# EAGLE design design (EAGLE 9.5.1)
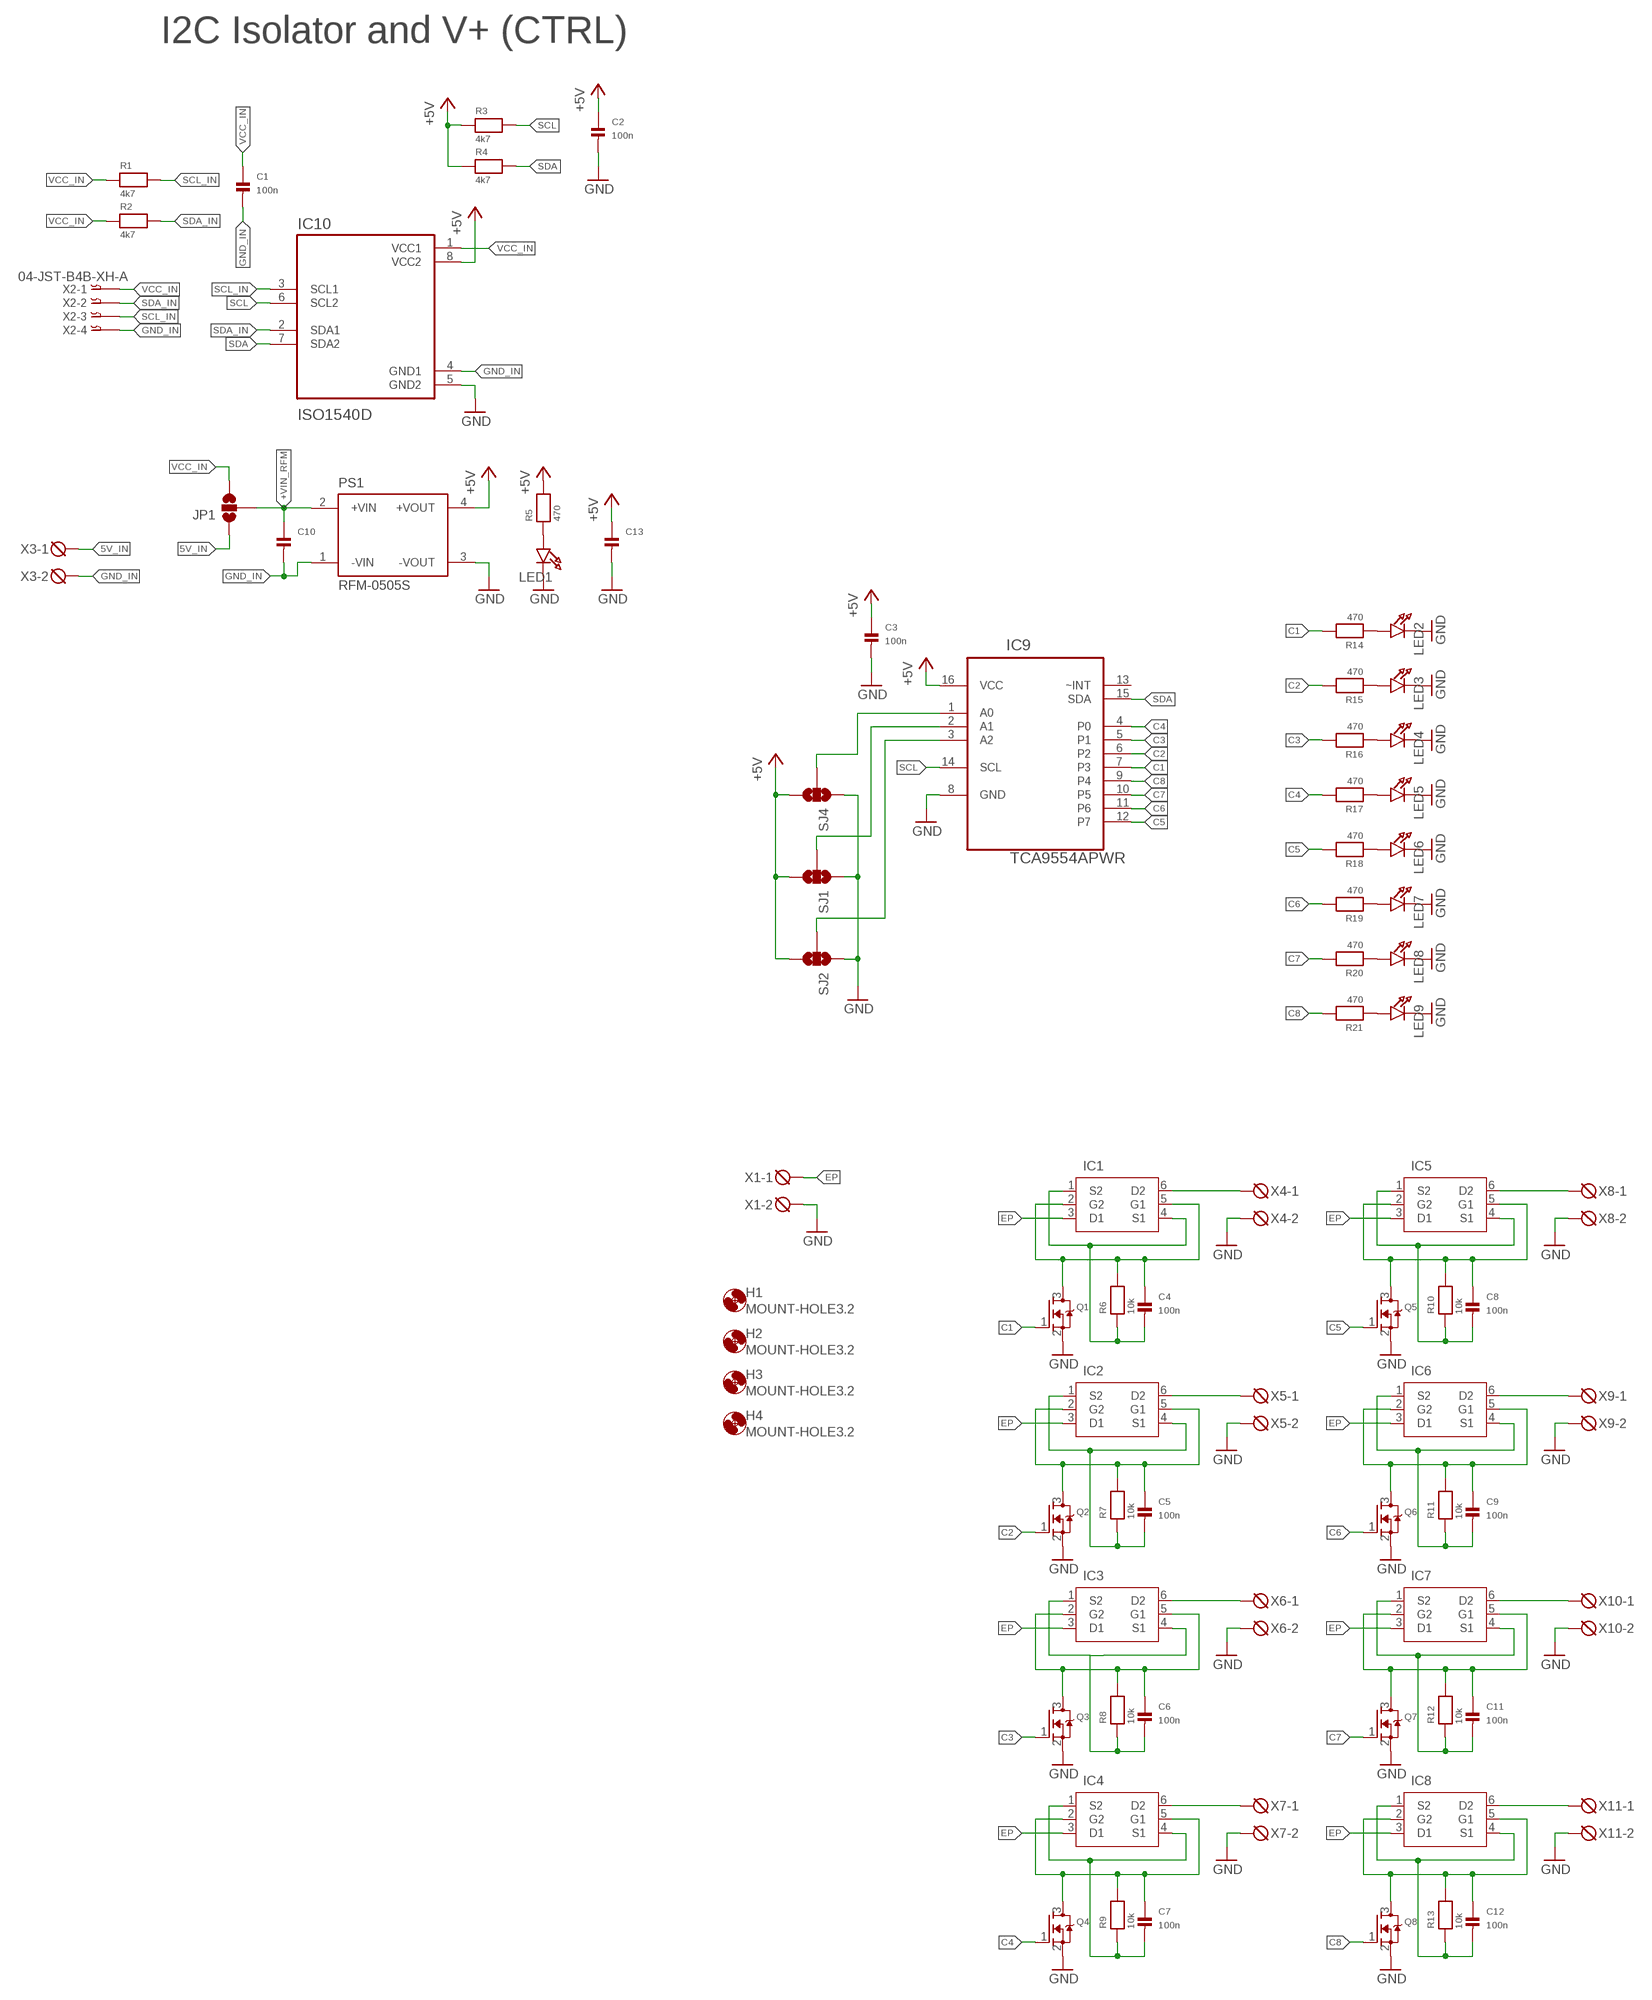
[diagram p0: schematic, sheet 1]

## Parts
C1  100n  CAP_CERAMIC0603  [0603]
C2  100n  CAP_CERAMIC0603  [0603]
C3  100n  CAP_CERAMIC0603  [0603]
C4  100n  CAP_CERAMIC0603  [0603]
C5  100n  CAP_CERAMIC0603  [0603]
C6  100n  CAP_CERAMIC0603  [0603]
C7  100n  CAP_CERAMIC0603  [0603]
C8  100n  CAP_CERAMIC0603  [0603]
C9  100n  CAP_CERAMIC0603  [0603]
C10  CAP_CERAMIC0805  [0805]
C11  100n  CAP_CERAMIC0603  [0603]
C12  100n  CAP_CERAMIC0603  [0603]
C13  CAP_CERAMIC0805  [0805]
H1  MOUNT-HOLE3.2  [3,2]
H2  MOUNT-HOLE3.2  [3,2]
H3  MOUNT-HOLE3.2  [3,2]
H4  MOUNT-HOLE3.2  [3,2]
IC1  DMP2200UDW  [SOT65P210X110-6N]
IC2  DMP2200UDW  [SOT65P210X110-6N]
IC3  DMP2200UDW  [SOT65P210X110-6N]
IC4  DMP2200UDW  [SOT65P210X110-6N]
IC5  DMP2200UDW  [SOT65P210X110-6N]
IC6  DMP2200UDW  [SOT65P210X110-6N]
IC7  DMP2200UDW  [SOT65P210X110-6N]
IC8  DMP2200UDW  [SOT65P210X110-6N]
IC9  TCA9554APWR  [SOP65P640X120-16N]
IC10  ISO1540D  [SOIC127P599X175-8N]
JP1  JUMPER-SMT_3_NO_SILK  [SMT-JUMPER_3_NO_SILK]
LED1  LED0805  [CHIPLED_0805]
LED2  LED0805  [CHIPLED_0805]
LED3  LED0805  [CHIPLED_0805]
LED4  LED0805  [CHIPLED_0805]
LED5  LED0805  [CHIPLED_0805]
LED6  LED0805  [CHIPLED_0805]
LED7  LED0805  [CHIPLED_0805]
LED8  LED0805  [CHIPLED_0805]
LED9  LED0805  [CHIPLED_0805]
PS1  RFM-0505S  [CONV_RFM-0505S]
Q1  MOSFET-NREFLOW  [SOT23-R]
Q2  MOSFET-NREFLOW  [SOT23-R]
Q3  MOSFET-NREFLOW  [SOT23-R]
Q4  MOSFET-NREFLOW  [SOT23-R]
Q5  MOSFET-NREFLOW  [SOT23-R]
Q6  MOSFET-NREFLOW  [SOT23-R]
Q7  MOSFET-NREFLOW  [SOT23-R]
Q8  MOSFET-NREFLOW  [SOT23-R]
R1  4k7  RESISTOR0603  [0603]
R2  4k7  RESISTOR0603  [0603]
R3  4k7  RESISTOR0603  [0603]
R4  4k7  RESISTOR0603  [0603]
R5  470  RESISTOR0603  [0603]
R6  10k  RESISTOR0603  [0603]
R7  10k  RESISTOR0603  [0603]
R8  10k  RESISTOR0603  [0603]
R9  10k  RESISTOR0603  [0603]
R10  10k  RESISTOR0603  [0603]
R11  10k  RESISTOR0603  [0603]
R12  10k  RESISTOR0603  [0603]
R13  10k  RESISTOR0603  [0603]
R14  470  RESISTOR0603  [0603]
R15  470  RESISTOR0603  [0603]
R16  470  RESISTOR0603  [0603]
R17  470  RESISTOR0603  [0603]
R18  470  RESISTOR0603  [0603]
R19  470  RESISTOR0603  [0603]
R20  470  RESISTOR0603  [0603]
R21  470  RESISTOR0603  [0603]
SJ1  SOLDERJUMPER_2WAYS  [SJ_3]
SJ2  SOLDERJUMPER_2WAYS  [SJ_3]
SJ4  SOLDERJUMPER_2WAYS  [SJ_3]
X1  DG3XX-02-5.0  [DG306-5.0-02P]
X2  04-JST-B4B-XH-A  [B4B-XH]
X3  DG3XX-02-5.0  [DG306-5.0-02P]
X4  DG3XX-02-5.0  [DG306-5.0-02P]
X5  DG3XX-02-5.0  [DG306-5.0-02P]
X6  DG3XX-02-5.0  [DG306-5.0-02P]
X7  DG3XX-02-5.0  [DG306-5.0-02P]
X8  DG3XX-02-5.0  [DG306-5.0-02P]
X9  DG3XX-02-5.0  [DG306-5.0-02P]
X10  DG3XX-02-5.0  [DG306-5.0-02P]
X11  DG3XX-02-5.0  [DG306-5.0-02P]

## Nets
5V_IN: JP1.1 X3.1
+5V: C2.1 C3.1 C13.1 IC9.16(VCC) IC10.8(VCC2) PS1.4(+VOUT) R3.1 R4.1 R5.2 SJ1.3 SJ2.3 SJ4.3
+VIN_RFM: C10.1 JP1.2 PS1.2(+VIN)
C1: IC9.7(P3) Q1.1(G) R14.2
C2: IC9.6(P2) Q2.1(G) R15.2
C3: IC9.5(P1) Q3.1(G) R16.2
C4: IC9.4(P0) Q4.1(G) R17.2
C5: IC9.12(P7) Q5.1(G) R18.2
C6: IC9.11(P6) Q6.1(G) R19.2
C7: IC9.10(P5) Q7.1(G) R20.2
C8: IC9.9(P4) Q8.1(G) R21.2
EP: IC1.3(D1) IC2.3(D1) IC3.3(D1) IC4.3(D1) IC5.3(D1) IC6.3(D1) IC7.3(D1) IC8.3(D1) X1.1
GND: C2.2 C3.2 C13.2 IC9.8(GND) IC10.5(GND2) LED1.C LED2.C LED3.C LED4.C LED5.C LED6.C LED7.C LED8.C LED9.C PS1.3(-VOUT) Q1.2(S) Q2.2(S) Q3.2(S) Q4.2(S) Q5.2(S) Q6.2(S) Q7.2(S) Q8.2(S) SJ1.1 SJ2.1 SJ4.1 X1.2 X4.2 X5.2 X6.2 X7.2 X8.2 X9.2 X10.2 X11.2
GND_IN: C1.2 C10.2 IC10.4(GND1) PS1.1(-VIN) X2.P$4 X3.2
N$1: C4.1 IC1.2(G2) IC1.5(G1) Q1.3(D) R6.2
N$2: C4.2 IC1.1(S2) IC1.4(S1) R6.1
N$3: C5.1 IC2.2(G2) IC2.5(G1) Q2.3(D) R7.2
N$4: IC1.6(D2) X4.1
N$5: IC9.1(A0) SJ4.2
N$6: IC9.2(A1) SJ1.2
N$7: IC9.3(A2) SJ2.2
N$10: IC2.6(D2) X5.1
N$11: C5.2 IC2.1(S2) IC2.4(S1) R7.1
N$14: IC3.6(D2) X6.1
N$15: C6.2 IC3.1(S2) IC3.4(S1) R8.1
N$18: IC4.6(D2) X7.1
N$19: C7.2 IC4.1(S2) IC4.4(S1) R9.1
N$22: IC5.6(D2) X8.1
N$23: C8.2 IC5.1(S2) IC5.4(S1) R10.1
N$26: IC6.6(D2) X9.1
N$27: C9.2 IC6.1(S2) IC6.4(S1) R11.1
N$29: C11.1 IC7.2(G2) IC7.5(G1) Q7.3(D) R12.2
N$30: LED1.A R5.1
N$31: IC7.6(D2) X10.1
N$32: C11.2 IC7.1(S2) IC7.4(S1) R12.1
N$35: IC8.6(D2) X11.1
N$36: C12.2 IC8.1(S2) IC8.4(S1) R13.1
N$37: LED2.A R14.1
N$38: LED3.A R15.1
N$39: LED4.A R16.1
N$40: LED5.A R17.1
N$41: LED6.A R18.1
N$42: LED7.A R19.1
N$43: LED8.A R20.1
N$44: LED9.A R21.1
N$45: C6.1 IC3.2(G2) IC3.5(G1) Q3.3(D) R8.2
N$46: C7.1 IC4.2(G2) IC4.5(G1) Q4.3(D) R9.2
N$47: C12.1 IC8.2(G2) IC8.5(G1) Q8.3(D) R13.2
N$49: C9.1 IC6.2(G2) IC6.5(G1) Q6.3(D) R11.2
N$50: C8.1 IC5.2(G2) IC5.5(G1) Q5.3(D) R10.2
SCL: IC9.14(SCL) IC10.6(SCL2) R3.2
SCL_IN: IC10.3(SCL1) R1.2 X2.P$3
SDA: IC9.15(SDA) IC10.7(SDA2) R4.2
SDA_IN: IC10.2(SDA1) R2.2 X2.P$2
VCC_IN: C1.1 IC10.1(VCC1) JP1.3 R1.1 R2.1 X2.P$1
Unconnected: IC9.13(~INT)

## Notes on the sheet
- I2C Isolator and V+ (CTRL)

## Library data of the parts
C1-C13 = microbuilder:CAP_CERAMIC: Ceramic Capacitors 0402 - 0402 Surface Mount Capacitors 16pF 50V 5% [Digikey: 445-4899-2-ND] 18pF 50V 5% [Digikey: 490-1281-2-ND] 22pF 50V 5% [Digikey: 490-1283-2-ND] 68pF 50V 5% [Digikey: 490-1289-2-ND] 0.1uF 10V 10% [Digikey: 490-1318-2-ND] 1.0uF 6.3V 10% [Digikey: 490-1320-2-ND] 0603 - 0603 Surface Mount Capacitors 16 pF 50V 5% [Digikey: 445-5051-2-ND] 22 pF 50V [Digikey: PCC220ACVTR-ND] 33 pF 50V 5% [Digikey: 490-1415-1-ND] 56pF 50V 5% [Digikey: 490-1421-1-ND] 220pF 50V 5% [Digikey: 445-1285-1-ND] 680 pF 50V 2200 pF 50V 5% C0G [Digikey: 445-1297-1-ND] 5600 pF 100V 5% X7R [Digikey: 478-3711-1-ND] 0.1 µF 25V 10% [Digikey: PCC2277TR-ND] 0.22 µF 16V 10% X7R [Digikey: 445-1318-1-ND] 1.0 µF 25V 10% [Digikey: 445-5146-2-ND] 0603 - RF Specific 3pF 250V +/-0.1pF RF [Digikey: 712-1347-1-ND] 18 pF 250V 5% [Digikey: 478-3505-1-ND or 712-1322-1-ND] 56 pF 250V 5% C0G RF [Digikey: 490-4867-1-ND] 68 pF 250V RF [Digikey: 490-4868-1-ND] 0805 - 0805 Surface Mount Capacitors 220 pF 250V 2% RF Ceramic Capacitor [Digikey: 712-1398-1-ND] 1000 pF 50V 2% NP0 Ceramic Capacitor [Digikey: 478-3760-1-ND] 0.1 µF 25V 10% Ceramic Capacitor [Digikey: PCC1828TR-ND] 1.0 µF 16V 10% Ceramic Capacitor[Digikey: 490-1691-2-ND] 10.0 µF 10V 10% Ceramic Capacitor[Digikey: 709-1228-1-ND] 10.0 uF 16V 10% Ceramic Capacitor [Digikey: 478-5165-2-ND] 47 uF 6.3V 20% Ceramic Capacitor [Digikey: 587-1779-1-ND or 399-5506-1-ND] 1206 - 1206 Surface Mount Capacitors 47uF 10V 20% Ceramic Capacitor [Digikey: 490-5528-1-ND or 399-5508-1-ND or 445-6010-1-ND] 100uF 6.3V -20%, +80% Y5V Ceramic Capacitor (Digikey: 490-4512-1-ND, Mouser: 81-GRM31CF50J107ZE1L)
H1-H4 = holes:MOUNT-HOLE: MOUNTING HOLE with drill center marker
IC1-IC8 = DMP2200UDW-7:DMP2200UDW
IC9 = TCA9554APWR:TCA9554APWR: 8-BIT I2C AND SMBus I/O EXPANDER; AVAILABILITY: Unavailable; DESCRIPTION: Remote 8-Bit I2C and SMBus I/O Expander 16-TSSOP -40 to 85; MF: Texas Instruments; MP: TCA9554APWR; PACKAGE: TSSOP-16 Texas Instruments; PRICE: None
IC10 = ISO1540D:ISO1540D: Check availability <https://pricing.snapeda.com/parts/ISO1540D/Texas%20Instruments/view-part?ref=eda>; AVAILABILITY: In Stock; CHECK_PRICES: https://www.snapeda.com/parts/ISO1540D/Texas+Instruments/view-part/?ref=eda; DESCRIPTION: 2.5-kVrms, isolated bidirectional clock, bidirectional I2C isolator; MF: Texas Instruments; MP: ISO1540D; PACKAGE: SOIC-8 Texas Instruments; PRICE: None; SNAPEDA_LINK: https://www.snapeda.com/parts/ISO1540D/Texas+Instruments/view-part/?ref=snap
JP1 = SparkFun-Jumpers:JUMPER-SMT_3_NO: Normally open jumper This jumper has three pads in close proximity to each other. Apply solder to close the connection(s).
LED1-LED9 = microbuilder:LED: LED 0603 - 0603 Surface Mount Package 2mA: Green LED - Low Power (3.9mcd, 2ma, 1.7Vf) - Digikey: 475-2709-2-ND Orange LED - Low Power (9.8mcd, 2ma, 1.8Vf) - Digikey: 475-1194-2-ND Red LED - Low Power (5mcd, 2ma, 1.8Vf) - Digikey: 475-1195-2-ND Yellow LED - Low Power (7mcd, 2ma, 1.8Vf) - Digikey: 475-1196-2-ND 5mA: Blue LED - Low Power (17mcd, 5ma, 2.9Vf) - Digikey: LNJ937W8CRACT-ND 0805 - 0805 Surface Mount Package 2mA: Red LED (8.8mcd, 2mA, 1.8Vf, Clear) - Low Power [Digikey: 475-2510-1-ND] Green LED (5mcd, 2mA, 1.8Vf, Clear) - Low Power [Digikey: 475-2730-1-ND] Yellow LED (11.3mcd, 2mA, 1.8Vf, Clear) - Low Power [Digikey: 475-2555-1-ND] 20mA: Red LED (104mcd, 20mA, Diffused) - LS R976 [Digikey: 475-1278-6-ND] Red LED (12mcd, 20mA, 2.0Vf, Clear) - APT2012EC [Digikey: 754-1128-1-ND] Green LED (15mcd, 20mA, 2.2Vf, Clear) - APT2012GC [Digikey: 754-1131-1-ND] Orange LED (160mcd, 20mA, 2.1Vf, Clear) - APT2012SECK [Digikey: 754-1130-1-ND] 1206 - 1206 Surface Mount Package Green LED (26mcd, 20mA, Diffused) - LG N971 [Digikey: 475-1407-6-ND] Red LED (15mcd, 20mA, Diffused) - LH N974 [Digikey: 475-1416-6-ND]
PS1 = RFM-0505S:RFM-0505S: DC/DC Converter, 1 Watt, SIP4, Single Output Check availability <https://pricing.snapeda.com/parts/RFM-0505S/Recom%20Power/view-part?ref=eda>; AVAILABILITY: In Stock; CHECK_PRICES: https://www.snapeda.com/parts/RFM-0505S/Recom+Power/view-part/?ref=eda; DESCRIPTION: DC-DC Converter, SIP4, 1kV unreg, Single Output, 1W, 5V Out, RFM Series | RECOM Power Inc. RFM-0505S; MF: Recom Power; MP: RFM-0505S; PACKAGE: SIP-4 Recom Power; PRICE: None; SNAPEDA_LINK: https://www.snapeda.com/parts/RFM-0505S/Recom+Power/view-part/?ref=snap
Q1-Q8 = microbuilder:MOSFET-N: N-Channel Mosfet LEGEND VDS: Voltage Drain-Source ID: Drain Current RDS(ON): Drain-Source On-State Resistance VGS(TH): Gate-Source Threshold Voltage CISS: Drain-Source Input Capacitance SOT-23 Name VDS ID RDS(ON) VGS(TH) CISS Order Number 2N7002E 60V 260mA 2.5 Ohm 2.5V @ 250uA 26.7pF @ 25V 2N7002ET1GOSTR-ND BSH103 30V 850mA 400 mOhm 400mV @ 1mA 83pF @ 24V BSH103,235-ND BSS138 60V 320mA 1.6 Ohm 1.5V @ 250uA 50pF @ 10V Mouser: 771-BSS138PW115 DMN2075U-7 20V 4.2A 38 mOhm 1V @ 250 uA 594.3pF @ 10V DMN2075U-7DICT-ND * BSS138 good choice for I2C level-shifting
R1-R21 = microbuilder:RESISTOR: Resistors 0402 - 0402 Surface Mount Package 22 Ohm 1% 1/16W [Digikey: 311-22.0LRTR-ND] 33 Ohm 5% 1/16W 1.0K 5% 1/16W 1.5K 5% 1/16W 2.0K 1% 1/16W 10.0K 1% 1/16W [Digikey: 311-10.0KLRTR-ND] 10.0K 5% 1/16W [Digikey: RMCF0402JT10K0TR-ND] 12.1K 1% 1/16W [Digikey: 311-22.0LRTR-ND] 100.0K 5% 1/16W 0603 - 0603 Surface Mount Package 0 Ohm 1/10 Watt 1% Resistor 15 Ohm 1/10 Watt 1% Resistor 33 Ohm 1/10 Watt 1% Resistor 49.9 Ohm 1/10 Watt 1% Resistor 100 Ohm 1/10 Watt 1% Resistor 150 Ohm 1/10 Watt 1% Resistor 240 Ohm 1/10 Watt 1% Resistor 390 Ohm 1/10 Watt 1% Resistor 560 Ohm 1/10 Watt 1% Resistor 680 Ohm 1/10 Watt 1% Resistor 750 Ohm 1/10 Watt 1% Resistor 1.0K Ohm 1/10 Watt 1% Resistor 1.5K Ohm 1/10 Watt 1% Resistor 2.0K Ohm 1/10 Watt 1% Resistor 2.2K Ohm 1/10 Watt 1% Resistor 3.3K Ohm 1/10 Watt 1% Resistor 4.7K Ohm 1/10 Watt 1% Resistor 10.0K Ohm 1/10 Watt 1% Resistor 12.0K Ohm 1/10 Watt 1% Resistor 12.1K Ohm 1/10 Watt 1% Resistor 20.0K Ohm 1/10 Watt 1% Resistor 33.0K Ohm 1/10 Watt 1% Resistor 100.0K Ohm 1/10 Watt 1% Resistor 0805 - 0805 Surface Mount Package 0 Ohm 1/8 Watt 1% Resistor 33 Ohm 1/8 Watt 1% Resistor 100 Ohm 1/8 Watt 1% Resistor 150 Ohm 1/8 Watt 1% Resistor 200 Ohm 1/8 Watt 1% Resistor 240 Ohm 1/8 Watt 1% Resistor 330 Ohm 1/8 Watt 1% Resistor 390 Ohm 1/8 Watt 1% Resistor 470 Ohm 1/8 Watt 1% Resistor 1.0K Ohm 1/8 Watt 1% Resistor 1.5K Ohm 1/8 Watt 1% Resistor 2.0K Ohm 1/8 Watt 1% Resistor 4.7K Ohm 1/8 Watt 1% Resistor 5.1K Ohm 1/8 Watt 1% Resistor 5.6K Ohm 1/8 Watt 1% Resistor 10.0K Ohm 1/8 Watt 1% Resistor 22.0K Ohm 1/8 Watt 1% Resistor 33.0K Ohm 1/8 Watt 1% Resistor 100K Ohm 1/8 Watt 1% Resistor 1206 - 1206 Surface Mount Package 2012 - 2010 Surface Mount Package 0.11 Ohm 1/2 Watt 1% Resistor - Digikey: RHM.11UCT-ND
SJ1 SJ2 SJ4 = SparkFun-Retired:SOLDERJUMPER_2WAY: Solder Jumper 2 way solder jumper
X1 X3-X11 = degson:DG3XX-02: DG350-3.5-02P DG306-5.0-02P
X2 = bt_con-jst-xh:04-JST: JST CONNECTOR

## Board
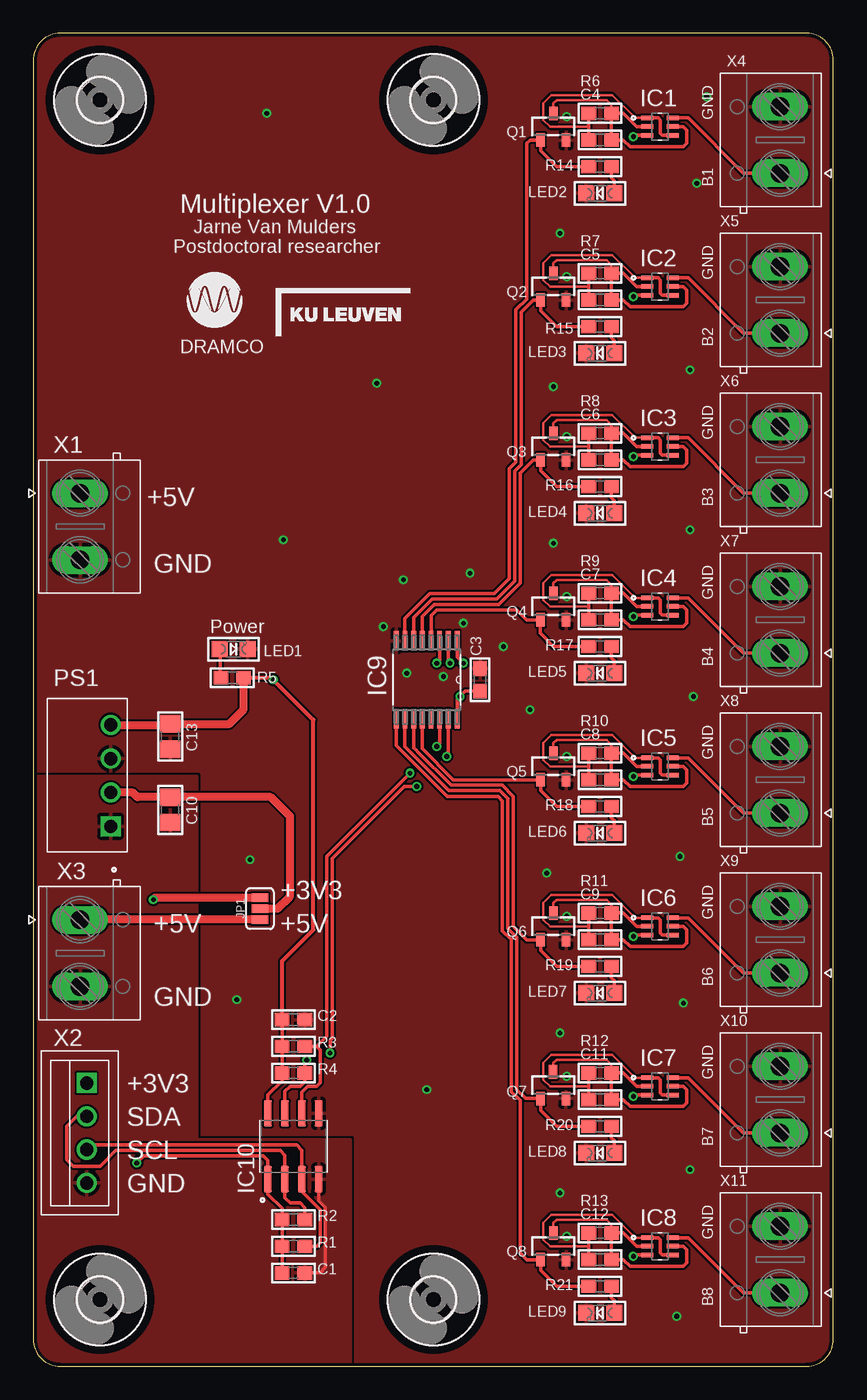
[diagram p1: board, top side]
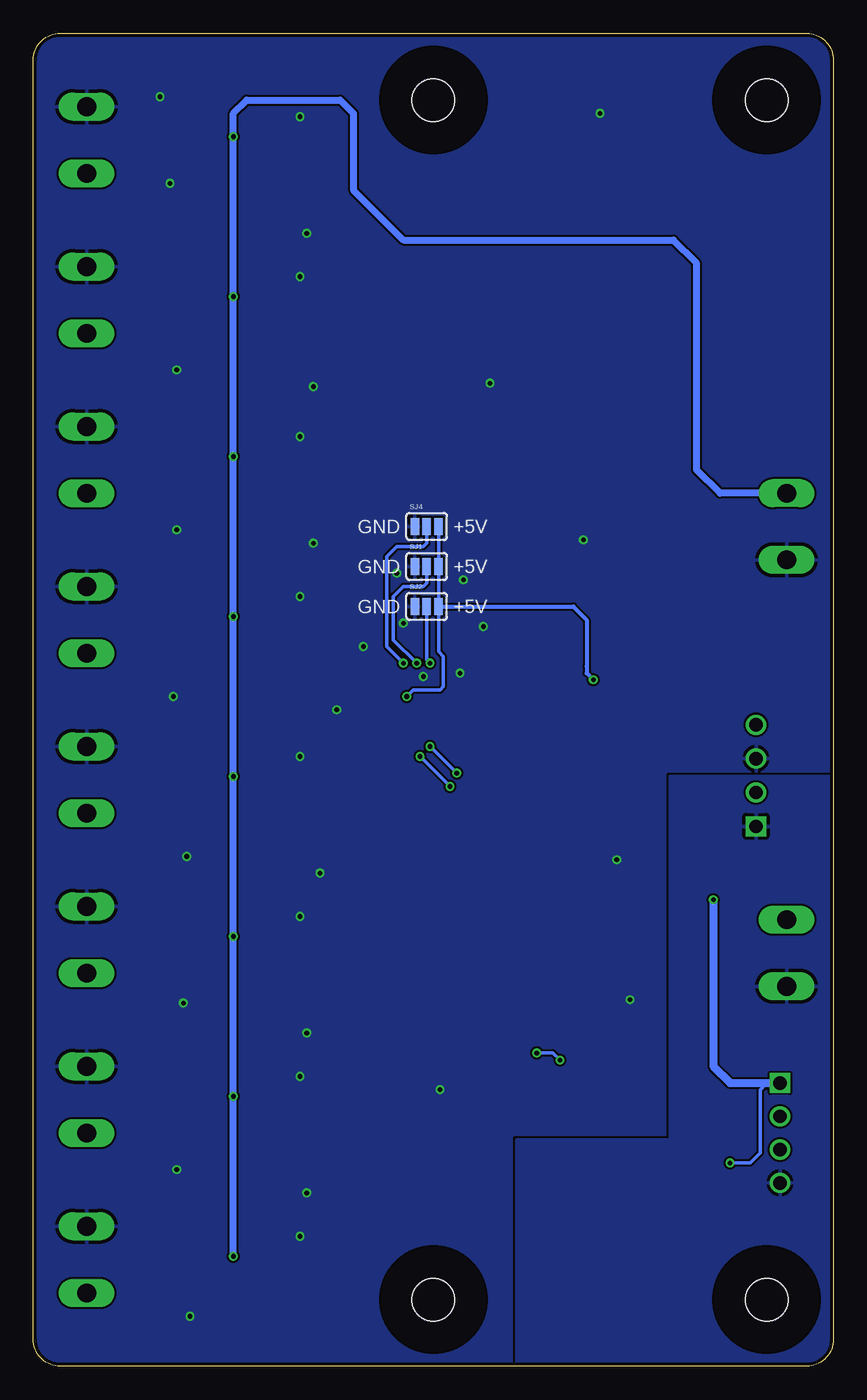
[diagram p2: board, bottom side, seen from below]

Size 60 x 100 mm. Coordinates in mm from the lower left corner, seen from the top.
Outline: 58,100 2,100 arc90 0,98 0,2 arc90 2,0 58,0 arc90 60,2 60,98 arc90 58,100
Copper layers (1*16): Top 0.035mm / dielectric 1.5mm / Bottom 0.035mm
Design rules "SeeedStudio_2layer_DRU_no_angle_20140221-2": minimum track width 6mil, minimum drill 12mil, track to track 6mil, track to pad 6mil, pad to pad 6mil, via to via 6mil, smd to smd 0mil, copper to edge 10mil, drill to drill 10mil, minimum pad ring 10mil, minimum via ring 6mil, stop-mask expansion 2mil, vias tented up to drill 100mil, thermal gap 10mil

### Footprints (pad centres in the part's own frame; a part is rotated, then mirrored left to right if it is on the bottom)
0603 = smd 1.1 x 1: 1 -0.85,0; 2 0.85,0
0805 = smd 1.3 x 1.5: 1 -0.95,0; 2 0.95,0
3,2 = hole 3.2: 0,0
SOT65P210X110-6N = smd 1 x 0.36: 1 -0.955,0.65; 2 -0.955,0; 3 -0.955,-0.65; 4 0.955,-0.65; 5 0.955,0; 6 0.955,0.65
SOP65P640X120-16N = smd 1.473 x 0.356: 1 -2.921,2.286; 2 -2.921,1.626; 3 -2.921,0.965; 4 -2.921,0.33; 5 -2.921,-0.33; 6 -2.921,-0.965; 7 -2.921,-1.626; 8 -2.921,-2.286; 9 2.921,-2.286; 10 2.921,-1.626; 11 2.921,-0.965; 12 2.921,-0.33; 13 2.921,0.33; 14 2.921,0.965; 15 2.921,1.626; 16 2.921,2.286
SOIC127P599X175-8N = smd 1.97 x 0.6: 1 -2.47,1.905; 2 -2.47,0.635; 3 -2.47,-0.635; 4 -2.47,-1.905; 5 2.47,-1.905; 6 2.47,-0.635; 7 2.47,0.635; 8 2.47,1.905
SMT-JUMPER_3_NO_SILK = smd 0.635 x 1.27: 1 -0.813,0; 2 0,0; 3 0.813,0
CHIPLED_0805 = smd 1.2 x 1.2: A 0,-1.05; C 0,1.05
CONV_RFM-0505S = drill 1 square: 1 -3.85,-1.75 | drill 1: 2 -1.31,-1.75; 3 1.23,-1.75; 4 3.77,-1.75
SOT23-R = smd 0.635 x 1.016: 1 -0.95,-1; 2 0.95,-1; 3 0,1
SJ_3 = smd 0.635 x 1.27: 1 -0.889,0; 2 0,0; 3 0.889,0
DG306-5.0-02P = drill 1.4 long: 1 -2.5,0; 2 2.5,0
B4B-XH = drill 1 square: P$1 3.75,0 | drill 1: P$2 1.25,0; P$3 -1.25,0; P$4 -3.75,0

### Placement (x,y rotation side)
C1  19.5,7 0 top
C2  19.5,26 0 top
C3  33.5,51.5 90 top
C4  42.5,92 180 top
C5  42.5,80 180 top
C6  42.5,68 180 top
C7  42.5,56 180 top
C8  42.5,44 180 top
C9  42.5,32 180 top
C10  10.25,41.75 270 top
C11  42.5,20 180 top
C12  42.5,8 180 top
C13  10.25,47.25 270 top
H1  5,5 0 top
H2  5,95 0 top
H3  30,95 0 top
H4  30,5 0 top
IC1  47,93 0 top
IC2  47,81 0 top
IC3  47,69 0 top
IC4  47,57 0 top
IC5  47,45 0 top
IC6  47,33 0 top
IC7  47,21 0 top
IC8  47,9 0 top
IC9  29.5,51.5 270 top
IC10  19.5,16.5 90 top
JP1  17,34.33 90 top
LED1  15.02,53.8 270 top
LED2  42.5,88 90 top
LED3  42.5,76 90 top
LED4  42.5,64 90 top
LED5  42.5,52 90 top
LED6  42.5,40 90 top
LED7  42.5,28 90 top
LED8  42.5,16 90 top
LED9  42.5,4 90 top
PS1  4.05,44.35 90 top
Q1  39,93 0 top
Q2  39,81 0 top
Q3  39,69 0 top
Q4  39,57 0 top
Q5  39,45 0 top
Q6  39,33 0 top
Q7  38.99,21.08 0 top
Q8  39,9 0 top
R1  19.5,9 0 top
R2  19.5,11 0 top
R3  19.5,24 0 top
R4  19.5,22 0 top
R5  14.92,51.64 0 top
R6  42.5,94 0 top
R7  42.5,82 0 top
R8  42.5,70 0 top
R9  42.5,58 0 top
R10  42.5,46 0 top
R11  42.5,34 0 top
R12  42.5,22 0 top
R13  42.5,10 0 top
R14  42.5,90 180 top
R15  42.5,78 180 top
R16  42.5,66 180 top
R17  42.5,54 180 top
R18  42.5,42 180 top
R19  42.5,30 180 top
R20  42.5,18 180 top
R21  42.5,6 180 top
SJ1  30.5,60 0 bottom
SJ2  30.5,57 0 bottom
SJ4  30.5,63 0 bottom
X1  3.5,63 270 top
X2  4,17.5 90 top
X3  3.5,31 270 top
X4  56,92 90 top
X5  56,80 90 top
X6  56,68 90 top
X7  56,56 90 top
X8  56,44 90 top
X9  56,32 90 top
X10  56,20 90 top
X11  56,8 90 top

### Tracks (layer width: path | path; a pad name or v marks a point on that pad's centre or on a via)
5V_IN
  Top 0.61: JP1.1 3.52,33.52 X3.1
+5V  (via drill 0.35)
  Top 0.254: C3.1 32.4,50.65 v32,50.25 31.79,50.04 IC9.16 | IC10.8 17.59,20.34 18.65,21.4 R4.1 R3.1 C2.1
  Top 0.305: C2.1 18.65,30.4 21,32.75 21,48.5 v18,51.5 17.86,51.64 R5.2
  Top 0.61: PS1.4 10.25,48.12 C13.1 14.7,48.2 15.77,49.27 R5.2
  Bottom 0.254: SJ4.3 SJ1.3 SJ2.3 29.61,53.61 29.25,53.25 29.25,51 29.5,50.75 31.5,50.75 v32,50.25
  Bottom 0.305: SJ2.3 27.5,57 19.5,57 18.5,56 18.5,52.5 18.5,52 v18,51.5
+VIN_RFM
  Top 0.61: JP1.2 18.33,34.33 19.25,35.25 19.25,41.25 17.8,42.7 C10.1 7.8,42.7 7.46,43.04 PS1.2
C1
  Top 0.254: R14.2 39.25,90 38.05,91.2 Q1.1 37.25,92 37,91.75 37,80.08 36.18,79.26 36.18,67.83 35.69,67.34 35.69,59.09 34.57,57.97 29.75,57.97 27.87,56.1 IC9.7
C2
  Top 0.254: R15.2 39.25,78 38.05,79.2 Q2.1 37.5,80 36.59,79.09 36.59,67.66 36.09,67.17 36.09,58.92 34.74,57.56 29.91,57.56 29.43,57.08 28.54,56.18 IC9.6
C3
  Top 0.254: IC9.5 29.17,56.24 30.08,57.16 34.91,57.16 36.5,58.75 36.5,67 37.5,68 Q3.1 38.05,67.2 39.25,66 R16.2
C4
  Top 0.254: IC9.4 29.83,56.33 30.25,56.75 36.25,56.75 37,56 Q4.1 38,55.95 38,55 39,54 R17.2
C5
  Top 0.254: R18.2 39.25,42 38.05,43.2 Q5.1 31.5,44 29.17,46.33 IC9.12
C6
  Top 0.254: R19.2 39.25,30 38.05,31.2 Q6.1 37,32 36,33 36,42.75 35.16,43.59 31.33,43.59 28.84,46.09 28.71,46.21 28.54,46.39 IC9.11
C7
  Top 0.254: R20.2 39.25,18 38.04,19.21 Q7.1 36.92,20.08 36.25,20.75 36.25,32.17 35.59,32.83 35.59,42.58 34.99,43.19 31.16,43.19 27.87,46.48 IC9.10
C8
  Top 0.254: R21.2 39.25,6 38.05,7.2 Q8.1 37,8 36.5,8.5 36.5,19.93 35.84,20.58 35.84,32.01 35.19,32.66 35.19,42.41 34.85,42.75 31.03,42.75 27.21,46.56 IC9.9
EP  (via drill 0.35)
  Top 0.254: IC8.3 45.1,8.35 v45,8.25 | IC7.3 45.1,20.35 v45,20.25 | IC6.3 45.1,32.35 v45,32.25 | IC5.3 45.1,44.35 v45,44.25 | IC4.3 45.1,56.35 v45,56.25 | IC3.3 45.1,68.35 v45,68.25 | IC2.3 45.1,80.35 v45,80.25 | IC1.3 45.1,92.35 v45,92.25
  Bottom 0.508: v45,8.25 v45,20.25 v45,32.25 v45,44.25 v45,56.25 v45,68.25 v45,80.25 v45,92.25 45,94 44,95 37,95 36,94 36,88.25 32.25,84.5 12,84.5 10.25,82.75 10.25,67.25 8.5,65.5 X1.1
GND  (via drill 0.35)
  other vias: 32.25,55.75 18.75,62 25.75,73.75 17.5,94 29.5,20.75 48.5,38.25 49.5,50.25 49.25,62.75 49.25,74.75 49.75,88.75 50.5,95.25 48.75,27.25 49.25,14.75 48.25,3.75 39.5,13 39.5,25 38.5,37 37.25,49.25 39,61.75 39,73.5 39.5,85 15.25,27.5 16.25,38 32.75,59.5 27.75,59 26.25,55.5 28,52 30.75,51.75 35.25,54 40,93.75 40,81.75 40,69.75 40,57.75 40,45.75 40,33.75 40,21.75 40,9.75
  pour Top (rank 5): -3,107 66,107 66,-7 -3,-7
  pour Bottom (rank 5): 67.5,110 -1.5,110 -1.5,-4 67.5,-4
GND_IN
  Top 0.254: C1.2 21.5,7 21.91,7.41 21.91,11.92 21.41,12.42 IC10.4
  pour Top: -1.75,44.25 12.25,44.25 12.25,17 23.75,17 23.75,-2.25 -1.75,-2.25
  pour Bottom: -1.75,44.25 12.25,44.25 12.25,17 23.75,17 23.75,-2.25 -1.75,-2.25
N$1
  Top 0.203: Q1.3 39,94.75 39.25,95 43,95 43.35,94.65 R6.2
  Top 0.254: IC1.2 45.25,93 44.25,94 R6.2 C4.1 44.25,92 44.75,91.5 48.75,91.5 49,91.75 49,92.75 48.75,93 IC1.5
N$2
  Top 0.203: IC1.1 45.14,93.65 43.43,95.36 38.86,95.36 38.25,94.75 38.25,93.5 38.75,93 41.65,93
  Top 0.254: R6.1 41.65,93 C4.2 | IC1.4 47.15,92.35 47,92.5 47,93.5 46.85,93.65 IC1.1
N$3
  Top 0.203: Q2.3 39,82.75 39.25,83 43,83 43.35,82.65 R7.2
  Top 0.254: IC2.2 45.25,81 44.25,82 R7.2 C5.1 44.25,80 44.75,79.5 48.75,79.5 49,79.75 49,80.75 48.75,81 IC2.5
N$4
  Top 0.254: X4.1 53.25,89.5 49.1,93.65 IC1.6
N$5  (via drill 0.35)
  Top 0.254: v32.25,52.75 31.79,53.21 IC9.1
  Bottom 0.254: SJ4.2 30.5,61.75 30.75,61.5 32.75,61.5 33.5,60.75 33.5,54 v32.25,52.75
N$6  (via drill 0.35)
  Top 0.254: v31.25,52.75 31.13,52.87 IC9.2
  Bottom 0.254: v31.25,52.75 33,54.5 33,57.75 32.25,58.5 30.75,58.5 30.5,58.75 SJ1.2
N$7  (via drill 0.35)
  Top 0.254: v30.25,52.75 30.46,52.97 IC9.3
  Bottom 0.254: SJ2.2 30.5,53 v30.25,52.75
N$10
  Top 0.254: X5.1 53.25,77.5 49.1,81.65 IC2.6
N$11
  Top 0.203: IC2.1 45.14,81.65 43.43,83.36 38.86,83.36 38.25,82.75 38.25,81.5 38.75,81 41.65,81
  Top 0.254: C5.2 41.65,81 R7.1 | IC2.4 47.15,80.35 47,80.5 47,81.5 46.85,81.65 IC2.1
N$14
  Top 0.254: X6.1 53.25,65.5 49.1,69.65 IC3.6
N$15
  Top 0.203: IC3.1 45.14,69.65 43.43,71.36 38.86,71.36 38.25,70.75 38.25,69.5 38.75,69 41.65,69
  Top 0.254: C6.2 41.65,69 R8.1 | IC3.4 47.15,68.35 47,68.5 47,69.5 46.85,69.65 IC3.1
N$18
  Top 0.254: X7.1 53.25,53.5 49.1,57.65 IC4.6
N$19
  Top 0.203: IC4.1 45.14,57.65 43.43,59.36 38.86,59.36 38.25,58.75 38.25,57.5 38.75,57 41.65,57
  Top 0.254: C7.2 41.65,57 R9.1 | IC4.4 47.15,56.35 47,56.5 47,57.5 46.85,57.65 IC4.1
N$22
  Top 0.254: X8.1 53.25,41.5 49.1,45.65 IC5.6
N$23
  Top 0.203: IC5.1 45.14,45.65 43.43,47.36 38.86,47.36 38.25,46.75 38.25,45.5 38.75,45 41.65,45
  Top 0.254: R10.1 41.65,45 C8.2 | IC5.4 47.15,44.35 47,44.5 47,45.5 46.85,45.65 IC5.1
N$26
  Top 0.254: X9.1 53.25,29.5 49.1,33.65 IC6.6
N$27
  Top 0.203: IC6.1 45.14,33.65 43.43,35.36 38.86,35.36 38.25,34.75 38.25,33.5 38.75,33 41.65,33
  Top 0.254: C9.2 41.65,33 R11.1 | IC6.4 47.15,32.35 47,32.5 47,33.5 46.85,33.65 IC6.1
N$29
  Top 0.203: Q7.3 38.99,22.74 39.25,23 43,23 43.35,22.65 R12.2
  Top 0.254: IC7.2 45.25,21 44.25,22 R12.2 C11.1 44.25,20 44.75,19.5 48.75,19.5 49,19.75 49,20.75 48.75,21 IC7.5
N$30
  Top 0.254: R5.1 14,51.71 14,53.77 LED1.A
N$31
  Top 0.254: X10.1 53.25,17.5 49.1,21.65 IC7.6
N$32
  Top 0.203: IC7.1 45.14,21.65 43.43,23.36 38.86,23.36 38.25,22.75 38.25,21.5 38.75,21 41.65,21
  Top 0.254: C11.2 41.65,21 R12.1 | IC7.4 47.15,20.35 47,20.5 47,21.5 46.85,21.65 IC7.1
N$35
  Top 0.254: X11.1 53.25,5.5 49.1,9.65 IC8.6
N$36
  Top 0.203: IC8.1 45.14,9.65 43.43,11.36 38.86,11.36 38.25,10.75 38.25,9.5 38.75,9 41.65,9
  Top 0.254: C12.2 41.65,9 R13.1 | IC8.4 47.15,8.35 47,8.5 47,9.5 46.85,9.65 IC8.1
N$37
  Top 0.254: R14.1 43.35,89.15 43.55,88.95 LED2.A
N$38
  Top 0.254: R15.1 43.35,77.15 43.55,76.95 LED3.A
N$39
  Top 0.254: R16.1 43.35,65.15 43.55,64.95 LED4.A
N$40
  Top 0.254: R17.1 43.35,53.15 43.55,52.95 LED5.A
N$41
  Top 0.254: R18.1 43.35,41.15 43.55,40.95 LED6.A
N$42
  Top 0.254: R19.1 43.35,29.15 43.55,28.95 LED7.A
N$43
  Top 0.254: R20.1 43.35,17.15 43.55,16.95 LED8.A
N$44
  Top 0.254: R21.1 43.35,5.15 43.55,4.95 LED9.A
N$45
  Top 0.203: Q3.3 39,70.75 39.25,71 43,71 43.35,70.65 R8.2
  Top 0.254: IC3.2 45.25,69 44.25,70 R8.2 C6.1 44.25,68 44.75,67.5 48.75,67.5 49,67.75 49,68.75 48.75,69 IC3.5
N$46
  Top 0.203: Q4.3 39,58.75 39.25,59 43,59 43.35,58.65 43.35,57.75
  Top 0.254: IC4.2 45.25,57 44.25,58 R9.2 43.35,57.75 C7.1 44.25,56 44.75,55.5 48.75,55.5 49,55.75 49,56.75 48.75,57 IC4.5
N$47
  Top 0.203: Q8.3 39,10.75 39.25,11 43,11 43.35,10.65 R13.2
  Top 0.254: IC8.2 45.25,9 44.25,10 R13.2 C12.1 44.25,8 44.75,7.5 48.75,7.5 49,7.75 49,8.75 48.75,9 IC8.5
N$49
  Top 0.203: Q6.3 39,34.75 39.25,35 43,35 43.35,34.65 R11.2
  Top 0.254: IC6.2 45.25,33 44.25,34 43.5,34 | 43.5,34 R11.2 | 43.5,34 43.35,33.85 C9.1 44.25,32 44.75,31.5 48.75,31.5 49,31.75 49,32.75 48.75,33 IC6.5
N$50
  Top 0.203: Q5.3 39,46.75 39.25,47 43,47 43.35,46.65 R10.2
  Top 0.254: IC5.2 45.25,45 44.25,46 R10.2 C8.1 44.25,44 44.75,43.5 48.75,43.5 49,43.75 49,44.75 48.75,45 IC5.5
SCL  (via drill 0.35)
  Top 0.254: IC10.6 20.14,20.56 20.57,21 21.25,21 21.5,21.25 21.5,23.75 21.25,24 | R3.2 21.25,24 | 21.25,24 22,24.75 22,38.25 v28.25,44.5 | v30.25,46.5 30.46,46.72 IC9.14
  Bottom 0.254: v28.25,44.5 v30.25,46.5
SCL_IN
  Top 0.254: X2.P$3 4.34,16.59 19.75,16.59 20.14,16.21 IC10.3 20.14,13.12 21.5,11.75 21.5,9.25 21.25,9 R1.2
SDA  (via drill 0.35)
  Top 0.254: IC10.7 18.86,20.61 19.25,21 20,21 20.35,21.35 R4.2 20.35,22.85 20.5,23 v20.5,22.97 | v22.25,23.5 22.25,24.43 22.41,24.58 22.41,38.08 27.82,43.5 v28.75,43.5 | IC9.15 31.13,45.88 v31,45.75
  Bottom 0.254: v20.5,22.97 21.03,23.5 v22.25,23.5 | v28.75,43.5 v31,45.75
SDA_IN
  Top 0.254: X2.P$2 3.25,18.75 2.5,18 2.5,15.5 3,15 5,15 6.19,16.19 18.5,16.19 18.86,15.82 IC10.2 18.86,12.63 19.25,12.25 20,12.25 20.35,11.9 R2.2
VCC_IN  (via drill 0.35)
  Top 0.254: v7.75,15.25 8.28,15.78 17.25,15.78 17.59,15.44 IC10.1 17.59,12.9 18.65,11.85 R2.1 R1.1 C1.1
  Top 0.61: JP1.3 9.14,35.14 v9,35
  Bottom 0.254: v7.75,15.25 6.25,15.25 5.5,16 5.5,20.75 5,21.25 X2.P$1
  Bottom 0.61: v9,35 9,22.5 7.75,21.25 X2.P$1

### Text on the board
tPlace: GND | B1 | Multiplexer V1.0 | Jarne Van Mulders | Postdoctoral researcher | GND | DRAMCO | B2 | GND | +5V | B3 | GND | GND | Power | B4 | GND | B5 | +3V3 | GND | +5V | +5V | B6 | GND | GND | +3V3 | SDA | SCL | B7 | GND | GND | B8
bPlace: GND | +5V | +5V | GND | GND | +5V